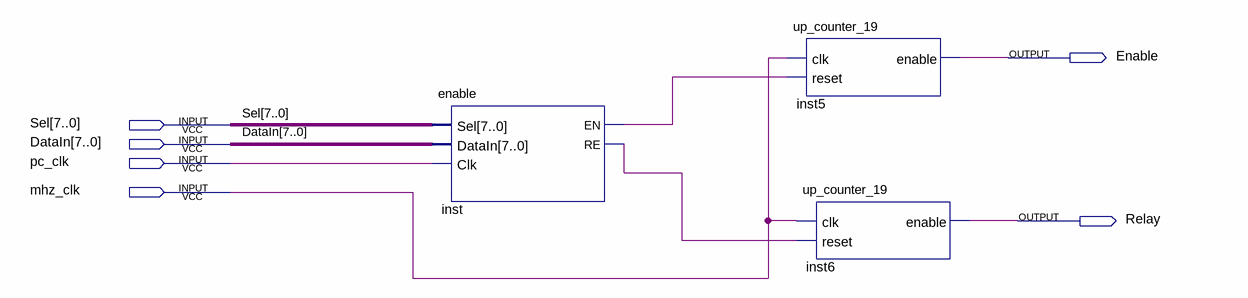
[diagram p0: schematic sheet]
// Quartus schematic enable_test.bdf as structural Verilog: 3 symbols, 6 pins
module enable_test (
  input  [7:0] Sel,
  input  [7:0] DataIn,
  input  pc_clk,
  input  mhz_clk,
  output Enable,
  output Relay
);

  wire inst_en, inst_re;

  enable inst (.Sel(Sel), .DataIn(DataIn), .Clk(pc_clk), .EN(inst_en), .RE(inst_re));
  up_counter_19 inst5 (.clk(mhz_clk), .reset(inst_en), .enable(Enable));
  up_counter_19 inst6 (.clk(mhz_clk), .reset(inst_re), .enable(Relay));
endmodule
